# EAGLE schematic logger (EAGLE 6.5.0)
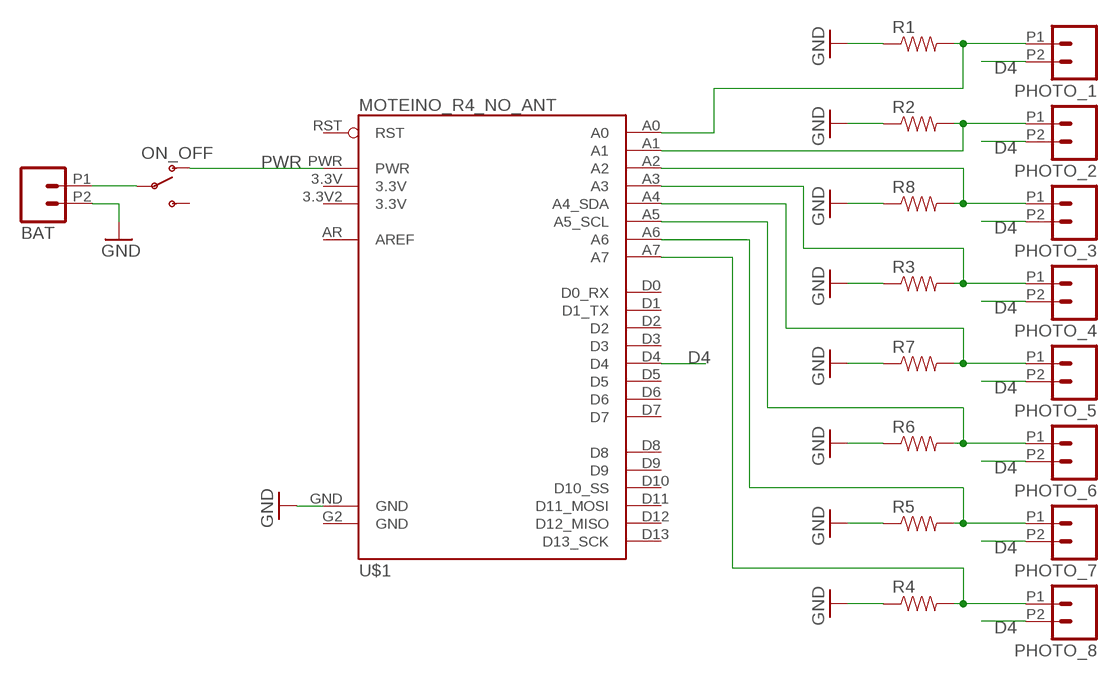
[diagram p0: schematic, sheet 1]

## Parts
BAT  M022.54MM_SCREWTERM  [1X02_2.54_SCREWTERM]
ON_OFF  SWITCH-SPDTPTH  [SWITCH-SPDT]
PHOTO_1  M022.54MM_SCREWTERM  [1X02_2.54_SCREWTERM]
PHOTO_2  M022.54MM_SCREWTERM  [1X02_2.54_SCREWTERM]
PHOTO_3  M022.54MM_SCREWTERM  [1X02_2.54_SCREWTERM]
PHOTO_4  M022.54MM_SCREWTERM  [1X02_2.54_SCREWTERM]
PHOTO_5  M022.54MM_SCREWTERM  [1X02_2.54_SCREWTERM]
PHOTO_6  M022.54MM_SCREWTERM  [1X02_2.54_SCREWTERM]
PHOTO_7  M022.54MM_SCREWTERM  [1X02_2.54_SCREWTERM]
PHOTO_8  M022.54MM_SCREWTERM  [1X02_2.54_SCREWTERM]
R1  RESISTORPTH-1/4W  [AXIAL-0.4]
R2  RESISTORPTH-1/4W  [AXIAL-0.4]
R3  RESISTORPTH-1/4W  [AXIAL-0.4]
R4  RESISTORPTH-1/4W  [AXIAL-0.4]
R5  RESISTORPTH-1/4W  [AXIAL-0.4]
R6  RESISTORPTH-1/4W  [AXIAL-0.4]
R7  RESISTORPTH-1/4W  [AXIAL-0.4]
R8  RESISTORPTH-1/4W  [AXIAL-0.4]
U$1  MOTEINO_R4_NO_ANT  [MOTEINO_R4_NO_ANT]

## Nets
D4: PHOTO_1.P2 PHOTO_2.P2 PHOTO_3.P2 PHOTO_4.P2 PHOTO_5.P2 PHOTO_6.P2 PHOTO_7.P2 PHOTO_8.P2 U$1.D4
GND: BAT.P2 R1.P$1 R2.P$1 R3.P$1 R4.P$1 R5.P$1 R7.P$1 R8.P$1 U$1.GND
N$1: PHOTO_1.P1 R1.P$2 U$1.A0
N$2: PHOTO_2.P1 R2.P$2 U$1.A1
N$3: PHOTO_3.P1 R8.P$2 U$1.A2
N$4: PHOTO_4.P1 R3.P$2 U$1.A3
N$5: PHOTO_5.P1 R7.P$2 U$1.A4(A4_SDA)
N$6: R6.P$1
N$8: BAT.P1 ON_OFF.2(P)
N$10: PHOTO_8.P1 R4.P$2 U$1.A7
N$11: PHOTO_7.P1 R5.P$2 U$1.A6
N$12: PHOTO_6.P1 R6.P$2 U$1.A5(A5_SCL)
PWR: ON_OFF.1(O) U$1.PWR
Unconnected: ON_OFF.3(S) U$1.3.3V U$1.3.3V2(3.3V) U$1.AR(AREF) U$1.D0(D0_RX) U$1.D1(D1_TX) U$1.D2 U$1.D3 U$1.D5 U$1.D6 U$1.D7 U$1.D8 U$1.D9 U$1.D10(D10_SS) U$1.D11(D11_MOSI) U$1.D12(D12_MISO) U$1.D13(D13_SCK) U$1.RST

## Power pins joined to a net without a drawn wire
GND: U$1.G2(GND)

## Library data of the parts
BAT PHOTO_1-PHOTO_8 = SparkFun-Connectors:M02: Standard 2-pin 0.1" header. Use with - straight break away headers ( PRT-00116) - right angle break away headers (PRT-00553) - swiss pins (PRT-00743) - machine pins (PRT-00117) - female headers (PRT-00115) Molex polarized connector foot print use with: PRT-08233 with associated crimp pins and housings. 2.54_SCREWTERM for use with PRT-10571. 3.5mm Screw Terminal footprints for PRT-08084 5mm Screw Terminal footprints for use with PRT-08432
ON_OFF = SparkFun-Electromechanical:SWITCH-SPDT: SPDT Switch Simple slide switch, Spark Fun Electronics SKU : COM-00102 DPDT SMT slide switch, AYZ0202, SWCH-08179; PROD_ID: SWCH-08261
R1-R8 = SparkFun-Resistors:RESISTOR: Resistor Basic schematic elements and footprints for 0603, 1206, and PTH resistors.
U$1 = MoteinoR4Mod:MOTEINO_R4_NO_ANT